# EAGLE design strip_02 (EAGLE 6.4)
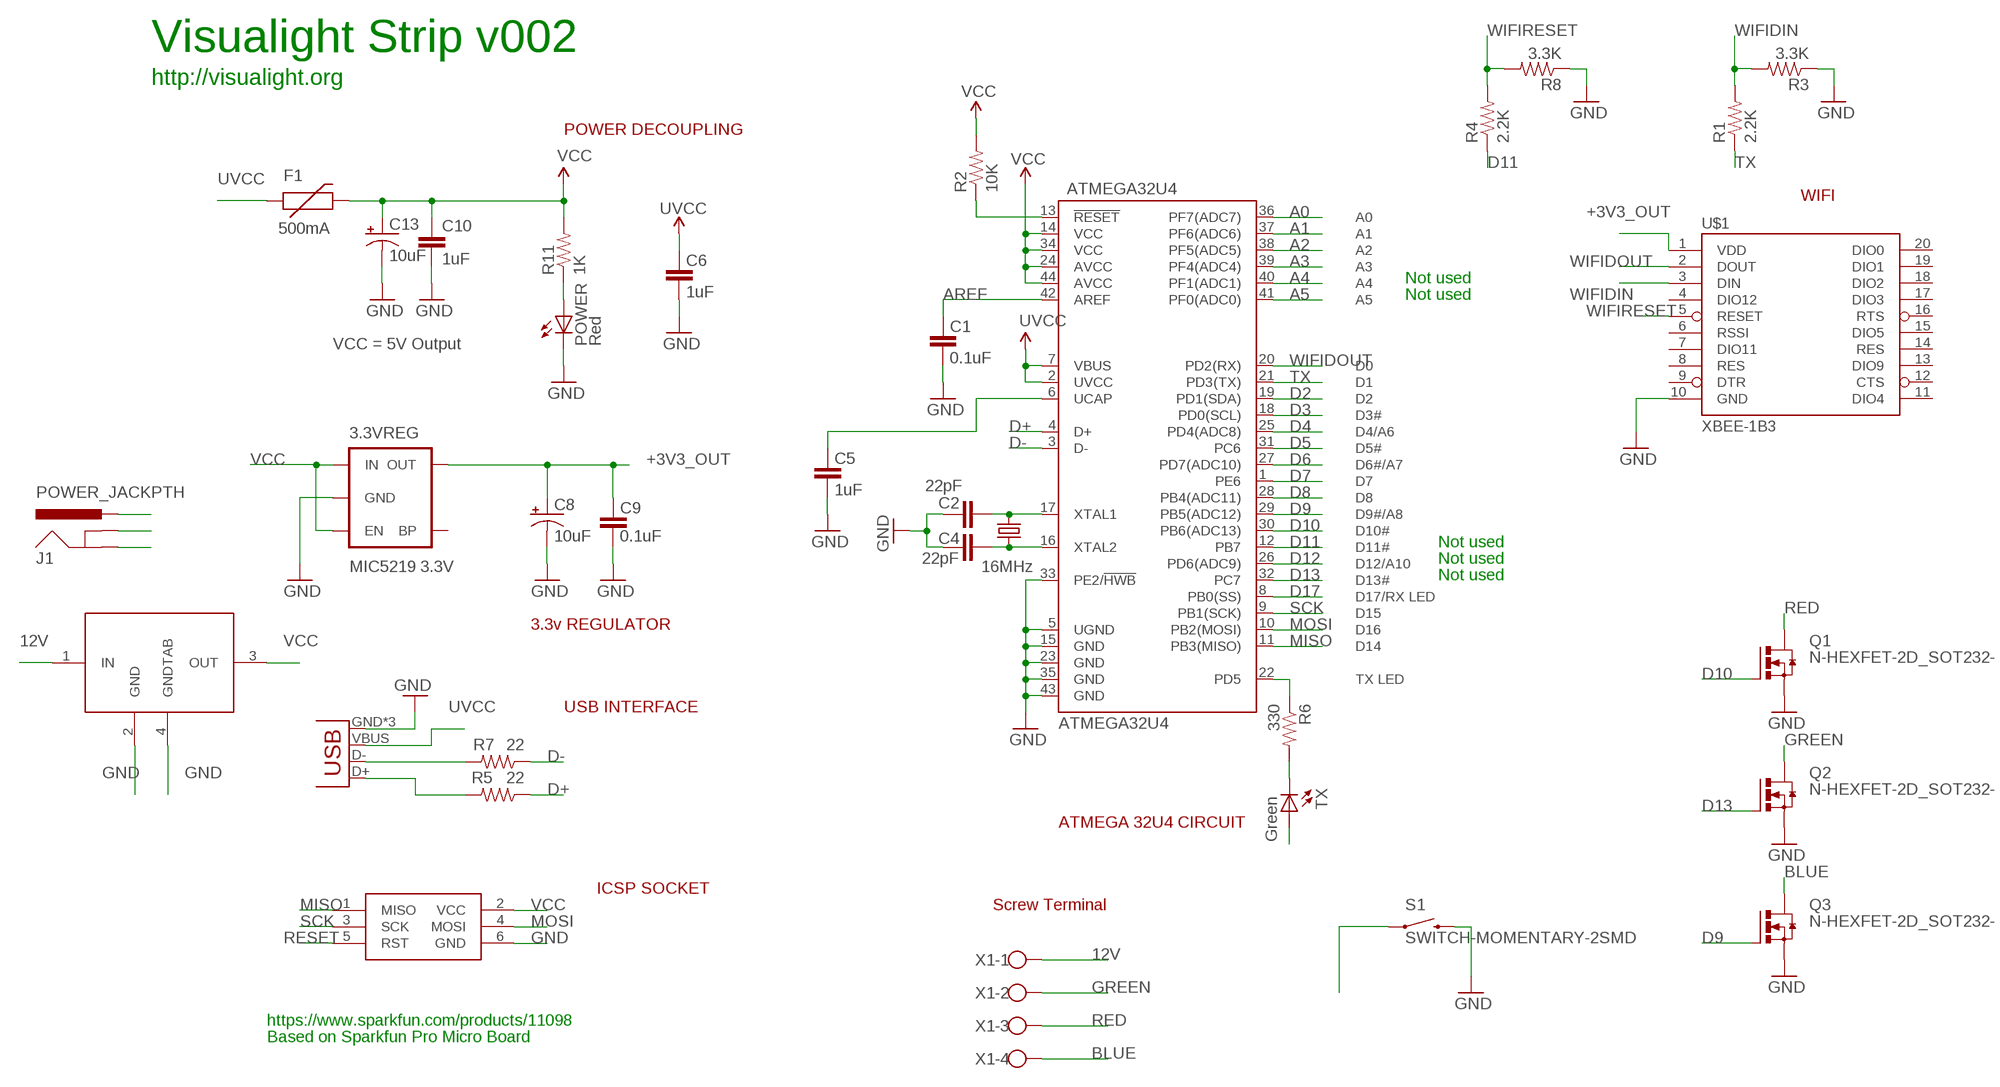
[diagram p0: schematic, sheet 1]

## Parts
3.3VREG  MIC5219 3.3V  V_REG_MIC52193.3V  [SOT23-5]
ATMEGA32U4  ATMEGA32U4  ATMEGA32U4TQFP  [SPARKFUN-DIGITALIC_TQFP44]
C1  0.1uF  CAP0402-CAP  [0402-CAP]
C2  22pF  CAP0402-CAP  [0402-CAP]
C4  22pF  CAP0402-CAP  [0402-CAP]
C5  1uF  CAP0402-CAP  [0402-CAP]
C6  1uF  CAP0402-CAP  [0402-CAP]
C8  10uF  CAP_POL1206  [EIA3216]
C9  0.1uF  CAP0402-CAP  [0402-CAP]
C10  1uF  CAP0402-CAP  [0402-CAP]
C13  10uF  CAP_POL1206  [EIA3216]
F1  500mA  PTCSMD  [PTC-1206]
ISP1  AVRISP-6  [AVRISP]
J1  POWER_JACKPTH  [POWER_JACK_PTH]
POWER  Red  LED0603  [LED-0603]
Q1  N-HEXFET-2D_SOT232-  [SOT223]
Q2  N-HEXFET-2D_SOT232-  [SOT223]
Q3  N-HEXFET-2D_SOT232-  [SOT223]
R1  2.2K  RESISTOR0402-RES  [0402-RES]
R2  10K  RESISTOR0402-RES  [0402-RES]
R3  3.3K  RESISTOR0402-RES  [0402-RES]
R4  2.2K  RESISTOR0402-RES  [0402-RES]
R5  22  RESISTOR0402-RES  [0402-RES]
R6  330  RESISTOR0402-RES  [0402-RES]
R7  22  RESISTOR0402-RES  [0402-RES]
R8  3.3K  RESISTOR0402-RES  [0402-RES]
R11  1K  RESISTOR0402-RES  [0402-RES]
S1  SWITCH-MOMENTARY-2SMD  [TACTILE_SWITCH_SMD]
TX  Green  LED0603  [LED-0603]
U$1  XBEE-1B3  [XBEE-SMD]
U$2  MIC5239  [SOT223]
X1  W237-4  [W237-4]
X2  USB-MICROB  [USB-MICROB]
Y1  16MHz  CRYSTAL5X3  [CRYSTAL-SMD-5X3]

## Nets
12V [mosfet]: J1.PWR U$2.1(IN) X1.1
+3V3_OUT: 3.3VREG.5(OUT) C8.A(+) C9.2 U$1.1(VDD)
A0: ATMEGA32U4.36(PF7(ADC7))
A1: ATMEGA32U4.37(PF6(ADC6))
A2: ATMEGA32U4.38(PF5(ADC5))
A3: ATMEGA32U4.39(PF4(ADC4))
A4: ATMEGA32U4.40(PF1(ADC1))
A5: ATMEGA32U4.41(PF0(ADC0))
AREF: ATMEGA32U4.42(AREF) C1.2
BLUE [mosfet]: Q3.2(D) Q3.4(D) X1.4
D2: ATMEGA32U4.19(PD1(SDA))
D3: ATMEGA32U4.18(PD0(SCL))
D4: ATMEGA32U4.25(PD4(ADC8))
D5: ATMEGA32U4.31(PC6)
D6: ATMEGA32U4.27(PD7(ADC10))
D7: ATMEGA32U4.1(PE6) S1.1
D8: ATMEGA32U4.28(PB4(ADC11))
D9: ATMEGA32U4.29(PB5(ADC12)) Q3.1(G)
D10: ATMEGA32U4.30(PB6(ADC13)) Q1.1(G)
D11: ATMEGA32U4.12(PB7) R4.1
D12: ATMEGA32U4.26(PD6(ADC9))
D13: ATMEGA32U4.32(PC7) Q2.1(G)
D17: ATMEGA32U4.8(PB0(SS))
D+: ATMEGA32U4.4(D+) R5.1
D-: ATMEGA32U4.3(D-) R7.1
GND [vcc]: 3.3VREG.2(GND) ATMEGA32U4.5(UGND) ATMEGA32U4.15(GND) ATMEGA32U4.23(GND) ATMEGA32U4.33(PE2/!HWB) ATMEGA32U4.35(GND) ATMEGA32U4.43(GND) C1.1 C2.2 C4.2 C5.1 C6.1 C8.C(-) C9.1 C10.2 C13.C(-) ISP1.6(GND) J1.GND J1.GNDBREAK POWER.C Q1.3(S) Q2.3(S) Q3.3(S) R3.1 R8.1 S1.3 U$1.10(GND) U$2.2(GND) U$2.4(GNDTAB) X2.GND X2.MT1(GND) X2.MT2(GND)
GREEN [mosfet]: Q2.2(D) Q2.4(D) X1.2
MISO: ATMEGA32U4.11(PB3(MISO)) ISP1.1(MISO)
MOSI: ATMEGA32U4.10(PB2(MOSI)) ISP1.4(MOSI)
N$1: ATMEGA32U4.16(XTAL2) C4.1 Y1.1
N$2: ATMEGA32U4.17(XTAL1) C2.1 Y1.3
N$4: ATMEGA32U4.6(UCAP) C5.2
N$6: R7.2 X2.D-
N$7: R6.2 TX.C
N$8: R5.2 X2.D+
N$38: POWER.A R11.1
RED [mosfet]: Q1.2(D) Q1.4(D) X1.3
RESET: ATMEGA32U4.13(!RESET) ISP1.5(RST) R2.1
SCK: ATMEGA32U4.9(PB1(SCK)) ISP1.3(SCK)
TX: ATMEGA32U4.21(PD3(TX)) R1.1
TXLED: ATMEGA32U4.22(PD5) R6.1
UVCC: ATMEGA32U4.2(UVCC) ATMEGA32U4.7(VBUS) C6.2 F1.1 X2.VBUS
VCC: 3.3VREG.1(IN) 3.3VREG.3(EN) ATMEGA32U4.14(VCC) ATMEGA32U4.24(AVCC) ATMEGA32U4.34(VCC) ATMEGA32U4.44(AVCC) C10.1 C13.A(+) F1.2 ISP1.2(VCC) R2.2 R11.2 TX.A U$2.3(OUT)
WIFIDIN: R1.2 R3.2 U$1.3(DIN)
WIFIDOUT: ATMEGA32U4.20(PD2(RX)) U$1.2(DOUT)
WIFIRESET: R4.2 R8.2 U$1.5(RESET)
Unconnected: 3.3VREG.4(BP) U$1.4(DIO12) U$1.6(RSSI) U$1.7(DIO11) U$1.8(RES) U$1.9(DTR) U$1.11(DIO4) U$1.12(CTS) U$1.13(DIO9) U$1.14(RES) U$1.15(DIO5) U$1.16(RTS) U$1.17(DIO3) U$1.18(DIO2) U$1.19(DIO1) U$1.20(DIO0)

## Notes on the sheet
- Visualight Strip v002
- http://visualight.org
- POWER DECOUPLING
- WIFI
- Not used
- Not used
- VCC = 5V Output
- Not used
- Not used
- Not used
- 3.3v REGULATOR
- USB INTERFACE
- ATMEGA 32U4 CIRCUIT
- ICSP SOCKET
- Screw Terminal
- https://www.sparkfun.com/products/11098
- Based on Sparkfun Pro Micro Board

## Library data of the parts
3.3VREG = SparkFun-PowerIC:V_REG_MIC5219: V_REG MIC5219 Standard 500mA LDO voltage regulator in SOT-23 layout. Micrel part MIC5219. BP (by-pass) pin is used to lower output noise with 470pF cap, may be left open.; PROD_ID: VREG-09872
ATMEGA32U4 = SparkFun-DigitalIC:ATMEGA32U4: Atmel 44-pin 8-bit Microcontroller with 32KBytes of ISP Flash and USB Controller
C1 C2 C4-C6 C9 C10 = SparkFun:CAP: Capacitor Standard 0603 ceramic capacitor, and 0.1" leaded capacitor.
C8 C13 = SparkFun:CAP_POL: Capacitor Polarized These are standard SMD and PTH capacitors. Normally 10uF, 47uF, and 100uF in electrolytic and tantalum varieties. Always verify the external diameter of the through hole cap, it varies with capacity, voltage, and manufacturer. The EIA devices should be standard.
F1 = SparkFun:PTC: Resettable Fuse PTC Resettable Fuse. Spark Fun Electronics SKU : COM-08357
ISP1 = adafruit:AVRISP: AVR ISP HEADER Standard 6 pin header for AVR programming
J1 = SparkFun-Connectors:POWER_JACK: Power Jack This is the standard 5.5mm barrel jack for power. The PTH is the most common, proven, reliable, footprint. The Slot footprint only works if the mill layer is transmitted to the PCB fab house so be warned. Spark Fun Electronics SKU : PRT-00119 SMT: CONN-08106 Mating wall wart : TOL-00298 (and others)
POWER TX = SparkFun:LED: LEDs Standard schematic elements and footprints for 5mm, 3mm, 1206, and 0603 sized LEDs. 5mm - Spark Fun Electronics SKU : COM-00529 (and others)
Q1-Q3 = transistor-power:N-HEXFET-2D_?-*: HEXFET® Power MOSFET 2 Drain connects http://www.irf.com/product-info/datasheets/data/irll014n.pdf
R1-R8 R11 = SparkFun:RESISTOR: Resistor Basic schematic elements and footprints for 0603, 1206, and PTH resistors.
S1 = SparkFun-Electromechanical:SWITCH-MOMENTARY-2: Various NO switches- pushbuttons, reed, etc
U$1 = SparkFun-RF:XBEE-1: Xbee module footprints SMT header is CONN-09042.; PROD_ID: CONN-09042
U$2 = v-reg:MIC5239
X1 = con-wago-500:W237-4: WAGO SCREW CLAMP; OC_FARNELL: unknown; OC_NEWARK: unknown
X2 = SparkFun-Connectors:USB: USB Connectors USB-B-PTH is fully proven SKU : PRT-00139/CONN-08278 USB-miniB is fully proven SKU : PRT-00587 USB-A-PCB is untested. USB-A-H is throughly reviewed, but untested. Spark Fun Electronics SKU : PRT-00437 USB-B-SMT is throughly reviewed, but untested. Needs silkscreen touching up. USB-A-S has not been used/tested USB-MB-H has not been used/tested USB-MICROB has been used. CONN-09505; PROD_ID: CONN-09505
Y1 = SparkFun:CRYSTAL: Crystals Various standard crystals. Proven footprints. Spark Fun Electronics SKU : COM-00534

## Net classes
0 default: width 0.406 mm, drill 0.254 mm, clearance 0.152 mm
1 vcc: width 0.61 mm
2 mosfet: width 0.61 mm

## Board
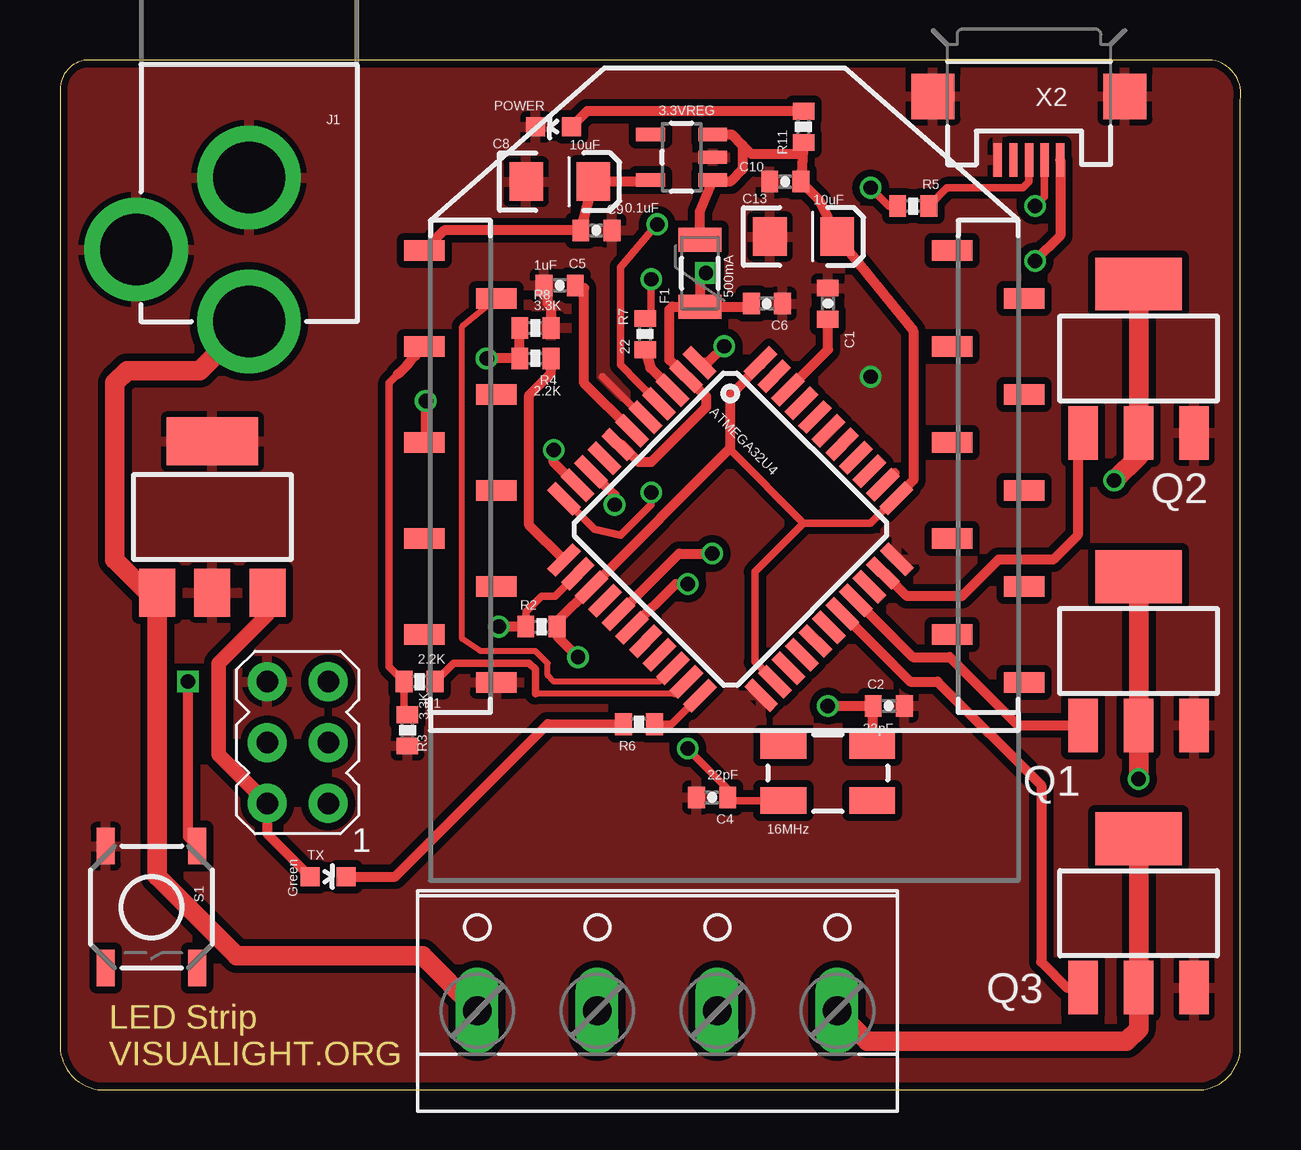
[diagram p1: board, top side]
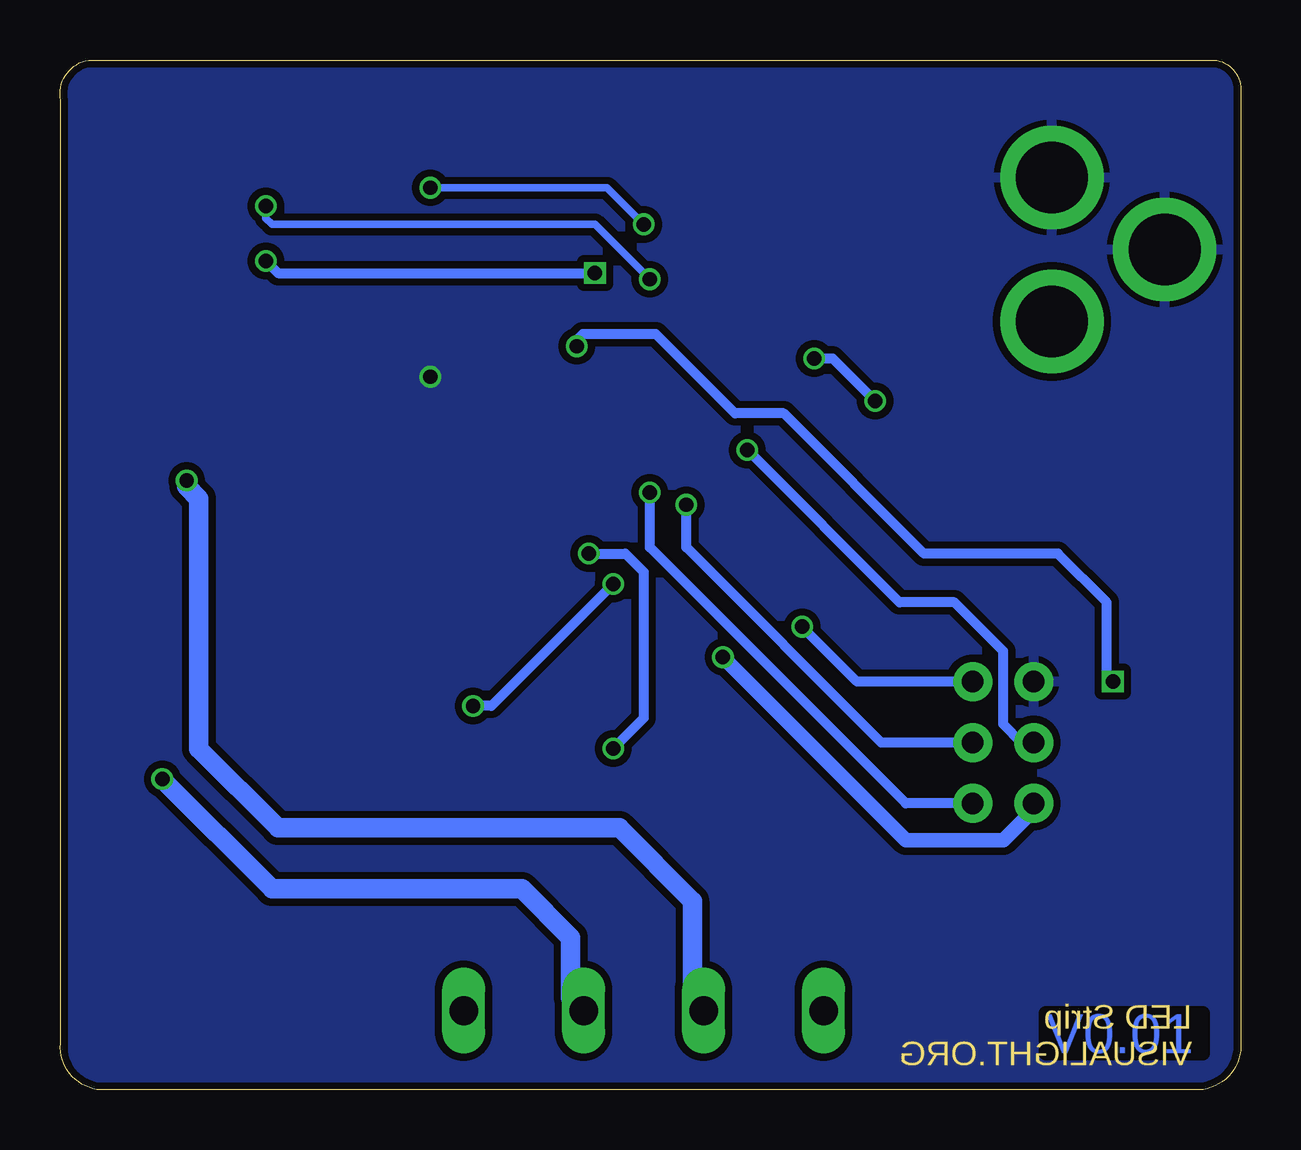
[diagram p2: board, bottom side, seen from below]

Size 49.23 x 42.92 mm. Coordinates in mm from the lower left corner, seen from the top.
Outline: 0,1.99 arc90 1.74,0 47.52,0 arc90 49.2,1.94 49.2,41.24 arc90 48.04,42.92 1.22,42.92 arc90 0,41.7 0,1.99
Copper layers (1*16): Top 0.035mm / dielectric 1.5mm / Bottom 0.035mm
Design rules "default": minimum track width 6mil, minimum drill 12mil, track to track 6mil, track to pad 6mil, pad to pad 6mil, via to via 6mil, smd to smd 0mil, copper to edge 10mil, drill to drill 10mil, minimum pad ring 10mil, minimum via ring 6mil, stop-mask expansion 2mil, vias tented up to drill 100mil, thermal gap 10mil

### Footprints (pad centres in the part's own frame; a part is rotated, then mirrored left to right if it is on the bottom)
SOT23-5 = smd 0.55 x 1.2: 1 -0.95,-1.3; 2 0,-1.3; 3 0.95,-1.3; 4 0.95,1.3; 5 -0.95,1.3
SPARKFUN-DIGITALIC_TQFP44 = smd 1.5 x 0.5: 1 -5.8,4; 2 -5.8,3.2; 3 -5.8,2.4; 4 -5.8,1.6; 5 -5.8,0.8; 6 -5.8,0; 7 -5.8,-0.8; 8 -5.8,-1.6; 9 -5.8,-2.4; 10 -5.8,-3.2; 11 -5.8,-4; 23 5.8,-4; 24 5.8,-3.2; 25 5.8,-2.4; 26 5.8,-1.6; 27 5.8,-0.8; 28 5.8,0; 29 5.8,0.8; 30 5.8,1.6; 31 5.8,2.4; 32 5.8,3.2; 33 5.8,4 | smd 0.5 x 1.5: 12 -4,-5.8; 13 -3.2,-5.8; 14 -2.4,-5.8; 15 -1.6,-5.8; 16 -0.8,-5.8; 17 0,-5.8; 18 0.8,-5.8; 19 1.6,-5.8; 20 2.4,-5.8; 21 3.2,-5.8; 22 4,-5.8; 34 4,5.8; 35 3.2,5.8; 36 2.4,5.8; 37 1.6,5.8; 38 0.8,5.8; 39 0,5.8; 40 -0.8,5.8; 41 -1.6,5.8; 42 -2.4,5.8; 43 -3.2,5.8; 44 -4,5.8
0402-CAP = smd 0.7 x 0.9: 1 -0.65,0; 2 0.65,0
EIA3216 = smd 1.4 x 1.6: A 1.4,0; C -1.4,0
PTC-1206 = smd 1 x 1.8: 1 -1.4,0; 2 1.4,0
AVRISP = drill 0.9 pad 1.626: 1 -1.27,2.54; 2 1.27,2.54; 3 -1.27,0; 4 1.27,0; 5 -1.27,-2.54; 6 1.27,-2.54
POWER_JACK_PTH = drill 2.997 pad 4.318: GND 0,7.7; GNDBREAK 4.7,10.7; PWR 0,13.7
LED-0603 = smd 0.8 x 0.8: A 0,-0.75; C 0,0.75
SOT223 = smd 1.219 x 2.235: 1 -2.311,-3.099; 2 0,-3.099; 3 2.311,-3.099 | smd 3.6 x 2.2: 4 0,3.099
0402-RES = smd 0.7 x 0.9: 1 -0.65,0; 2 0.65,0
TACTILE_SWITCH_SMD = smd 1.524 x 0.762: 1 -2.54,1.905; 2 2.54,1.905; 3 -2.54,-1.905; 4 2.54,-1.905
XBEE-SMD = smd 1.7 x 0.85: 1 -12.5,20; 2 -9.5,18; 3 -12.5,16; 4 -9.5,14; 5 -12.5,12; 6 -9.5,10; 7 -12.5,8; 8 -9.5,6; 9 -12.5,4; 10 -9.5,2; 11 12.5,2; 12 9.5,4; 13 12.5,6; 14 9.5,8; 15 12.5,10; 16 9.5,12; 17 12.5,14; 18 9.5,16; 19 12.5,18; 20 9.5,20
SOT223' = smd 1.5 x 2: 1 -2.3,-3.15; 2 0,-3.15; 3 2.3,-3.15 | smd 3.8 x 2: 4 0,3.15
W237-4 = drill 1.194 long: 1 -7.5,-1.27; 2 -2.5,-1.27; 3 2.5,-1.27; 4 7.5,-1.27
USB-MICROB = smd 0.35 x 1.4: D+ 0,2.65; D- -0.65,2.65; GND 1.3,2.65; ID 0.65,2.65; VBUS -1.3,2.65 | smd 1.8 x 1.9: MT1 -4,0; MT2 4,0
CRYSTAL-SMD-5X3 = smd 1.9 x 1.1: 1 -1.85,-1.15; 2 1.85,-1.15; 3 1.85,1.15; 4 -1.85,1.15

### Placement (x,y rotation side)
3.3VREG  25.91,38.86 90 top
ATMEGA32U4  27.94,23.37 315.1 top
C1  32.01,32.77 270 top
C2  34.55,16 0 top
C4  27.18,12.19 180 top
C5  20.83,33.53 0 top
C6  29.47,32.77 180 top
C8  20.83,37.85 0 top
C9  22.36,35.81 180 top
C10  30.23,37.85 180 top
C13  30.99,35.56 0 top
F1  26.67,34.04 90 top
ISP1  9.91,14.48 180 top
J1  7.88,45.72 180 top
POWER  20.58,40.13 90 top
Q1  44.96,18.29 0 top
Q2  44.96,30.48 0 top
Q3  44.96,7.37 0 top
R1  14.99,17.02 180 top
R2  20.07,19.3 0 top
R3  14.48,14.99 90 top
R4  19.82,30.48 180 top
R5  35.56,36.83 0 top
R6  24.13,15.24 180 top
R7  24.39,31.5 90 top
R8  19.82,31.75 180 top
R11  30.99,40.13 270 top
S1  3.81,7.62 270 top
TX  11.18,8.89 270 top
U$1  27.69,14.99 0 top
U$2  MIC5239  [SOT223']  6.35,23.88 0 top
X1  24.9,4.57 0 top
X2  40.39,41.4 180 top
Y1  32.01,13.21 0 top

### Tracks (layer width: path | path; a pad name or v marks a point on that pad's centre or on a via)
12V
  Top 0.813: J1.PWR 5.83,29.97 2.8,29.97 2.29,29.46 2.29,22.1 3.66,20.73 U$2.1 4.05,8.9 7.37,5.59 15.11,5.59 X1.1
+3V3_OUT
  Top 0.406: 3.3VREG.5 24.55,37.85 C8.A 22.21,37.83 C9.2 16.02,35.81 U$1.1
AREF
  Top 0.406: ATMEGA32U4.42 32.01,30.85 C1.2
BLUE
  Top 0.813: Q3.4 Q3.2 44.96,2.54 44.45,2.03 33.67,2.03 X1.4
D2
  Top 0.406: ATMEGA32U4.19
D7  (via drill 0.6)
  Top 0.406: S1.1 5.34,10.54 v5.34,17.02 | v27.69,30.99 27,30.29 ATMEGA32U4.1
  Bottom 0.406: v5.34,17.02 5.59,17.27 5.59,20.32 7.62,22.35 13.21,22.35 19.05,28.19 21.09,28.19 24.39,31.5 27.44,31.5 27.69,31.24 v27.69,30.99
D9
  Top 0.406: ATMEGA32U4.29 35.44,17.02 36.58,17.02 40.9,12.7 40.9,5.33 41.96,4.27 Q3.1
D10
  Top 0.406: ATMEGA32U4.30 35.55,18.03 37.09,18.03 39.93,15.19 Q1.1
D11
  Top 0.406: ATMEGA32U4.12 19.56,23.54 19.56,28.96 20.47,29.86 R4.1
D13
  Top 0.406: Q2.1 42.42,27.15 42.42,23.11 41.41,22.1 39.12,22.1 37.6,20.57 35.31,20.57 34.34,21.54 ATMEGA32U4.32
D+  (via drill 0.6)
  Top 0.305: R5.1 34.55,36.83 v33.79,37.59 | ATMEGA32U4.4 24.1,29.46 23.37,30.23 23.37,34.29 v24.9,36.07
  Bottom 0.305: v33.79,37.59 26.42,37.59 v24.9,36.07
D-
  Top 0.406: R7.1 24.61,30.08 ATMEGA32U4.3
GND  (via drill 0.6)
  Top 0.305: ATMEGA32U4.5 24.3,28.03 22.61,29.72
  Top 0.406: ATMEGA32U4.35 34.8,25.71 | C5.1 20.32,33.39 20.32,32.77 20.47,32.62 R8.1
  other vias: 33.79,29.72
  pour Top (isolate 0.305): 0,42.93 49.03,42.93 49.28,0 -0.25,0.25
  pour Bottom (isolate 0.305): -0.25,42.93 49.03,42.93 49.28,0 -0.25,0.25
GREEN  (via drill 0.6)
  Top 0.813: Q2.4 Q2.2 44.96,26.42 v43.95,25.4
  Bottom 0.813: v43.95,25.4 43.95,25.15 43.44,24.64 43.44,14.22 40.14,10.92 25.91,10.92 22.86,7.87 22.86,3.77 X1.2
MISO  (via drill 0.6)
  Top 0.305: ATMEGA32U4.11 22.27,23.37 23.37,23.11 24.64,24.38 v24.64,24.89
  Bottom 0.406: ISP1.1 13.97,11.94 24.64,22.61 v24.64,24.89
MOSI  (via drill 0.6)
  Top 0.406: ATMEGA32U4.10 21.54,25.19 20.58,26.16 v20.58,26.67
  Bottom 0.406: ISP1.4 9.15,14.48 9.91,15.24 9.91,18.29 11.94,20.32 14.23,20.32 v20.58,26.67
N$1  (via drill 0.6)
  Top 0.305: v26.17,14.22 27.83,12.56 C4.1 27.97,12.06 Y1.1
  Top 0.406: ATMEGA32U4.16 25.81,22.35 v27.18,22.35
  Bottom 0.406: v27.18,22.35 25.66,22.35 24.9,21.59 24.9,15.49 v26.17,14.22
N$2  (via drill 0.6)
  Top 0.406: ATMEGA32U4.17 25.66,21.08 v26.17,21.08 | v32.01,16 C2.1 33.86,15.96 Y1.3
  Bottom 0.406: v26.17,21.08 31.25,16 v32.01,16
N$4
  Top 0.406: ATMEGA32U4.6 21.85,29.45 21.85,33.39 C5.2 21.85,33.42
N$6  (via drill 0.6)
  Top 0.305: X2.D- 41.04,37.23 v40.64,36.83 | v24.64,33.78 24.64,32.4 R7.2
  Bottom 0.305: v40.64,36.83 40.64,36.32 40.39,36.07 26.93,36.07 v24.64,33.78
N$7
  Top 0.406: TX.C 13.97,8.89 20.32,15.24 R6.2
N$8
  Top 0.305: X2.D+ 40.39,37.85 40.14,37.59 36.98,37.59 R5.2
N$38
  Top 0.406: R11.1 21.98,40.78 POWER.A
RED  (via drill 0.6)
  Top 0.813: v44.96,12.95 Q1.2 Q1.4
  Bottom 0.813: v44.96,12.95 40.39,8.38 29.98,8.38 27.94,6.35 27.94,3.85 X1.3
RESET  (via drill 0.6)
  Top 0.305: 19.42,19.36 19.42,19.92 20.07,20.57 20.64,20.57 ATMEGA32U4.13
  Top 0.406: 19.42,19.36 R2.1 v18.29,19.3
  Bottom 0.406: ISP1.5 16.01,17.02 v18.29,19.3
SCK  (via drill 0.6)
  Top 0.406: ATMEGA32U4.9 23.12,24.79 v23.12,24.38
  Bottom 0.406: ISP1.3 14.99,14.48 23.12,22.61 v23.12,24.38
TX
  Top 0.254: 25.63,16.51 19.82,16.51
  Top 0.305: ATMEGA32U4.21 25.63,16.51 | 19.82,16.51 19.82,17.53 19.56,17.78 16.4,17.78 R1.1
TXLED
  Top 0.305: R6.1 25.49,15.24 ATMEGA32U4.22
UVCC  (via drill 0.6)
  Top 0.406: F1.1 25.53,32.64 25.4,32.51 25.4,30.42 ATMEGA32U4.2 26.93,28.89 26.93,28.45 24.64,26.16 24.13,26.16 23.4,26.89 ATMEGA32U4.7 | F1.1 28.69,32.64 C6.2 | X2.VBUS 41.69,35.59 v40.64,34.54 | v26.93,34.04 26.67,33.78 F1.1
  Bottom 0.406: v40.64,34.54 40.14,34.04 v26.93,34.04
VCC  (via drill 0.6)
  Top 0.254: 35.56,31.75 35.56,31.63
  Top 0.305: ATMEGA32U4.24 28.96,17.84 28.96,21.59 30.99,23.62 | ATMEGA32U4.34 34.8,24.64 33.79,23.62 30.99,23.62 | 30.99,23.62 27.94,26.67
  Top 0.406: 27.9,26.71 ATMEGA32U4.14 20.72,19.52 R2.2 20.72,18.91 v21.59,18.03 | 27.9,26.71 27.94,26.75 27.94,28.96 29.2,30.22 ATMEGA32U4.44 | 34.8,24.64 34.82,24.65 | ATMEGA32U4.34 34.87,24.71 35.56,25.4 35.56,31.63 C13.A 31.63,37.1 C10.1 R11.2 30.73,39 28.83,39 28.45,39.37 | F1.2 26.67,36.61 3.3VREG.1 27.28,37.85 27.94,37.85 28.45,38.35 28.45,39.37 | 3.3VREG.3 28.01,39.81 28.45,39.37 | 27.94,26.67 | 27.94,26.67 27.9,26.71 | ISP1.2 8.64,10.68 TX.A
  Top 0.61: U$2.3 8.65,19.83 6.61,17.78 6.61,13.97 ISP1.2
  Bottom 0.61: v21.59,18.03 13.97,10.41 9.91,10.41 8.64,11.68 ISP1.2
WIFIDIN
  Top 0.305: R3.2 14.34,15.78 R1.2 13.72,17.64 13.72,29.46 14.84,30.58 14.84,30.63
  Top 0.406: U$1.3 14.84,30.63 14.68,30.48 14.48,30.23 14.09,29.83
WIFIDOUT
  Top 0.254: ATMEGA32U4.20 25,17.02 20.58,17.02 20.32,17.27 20.32,17.78 19.82,18.29 17.53,18.29 16.77,18.8 16.77,31.82 U$1.2
WIFIRESET  (via drill 0.6)
  Top 0.406: R8.2 R4.2 v17.78,30.48 | v15.24,28.7 15.24,27.04 U$1.5
  Bottom 0.406: v17.78,30.48 17.02,30.48 v15.24,28.7

### Text on the board
Bottom: V0.01
Dimension: LED Strip | VISUALIGHT.ORG